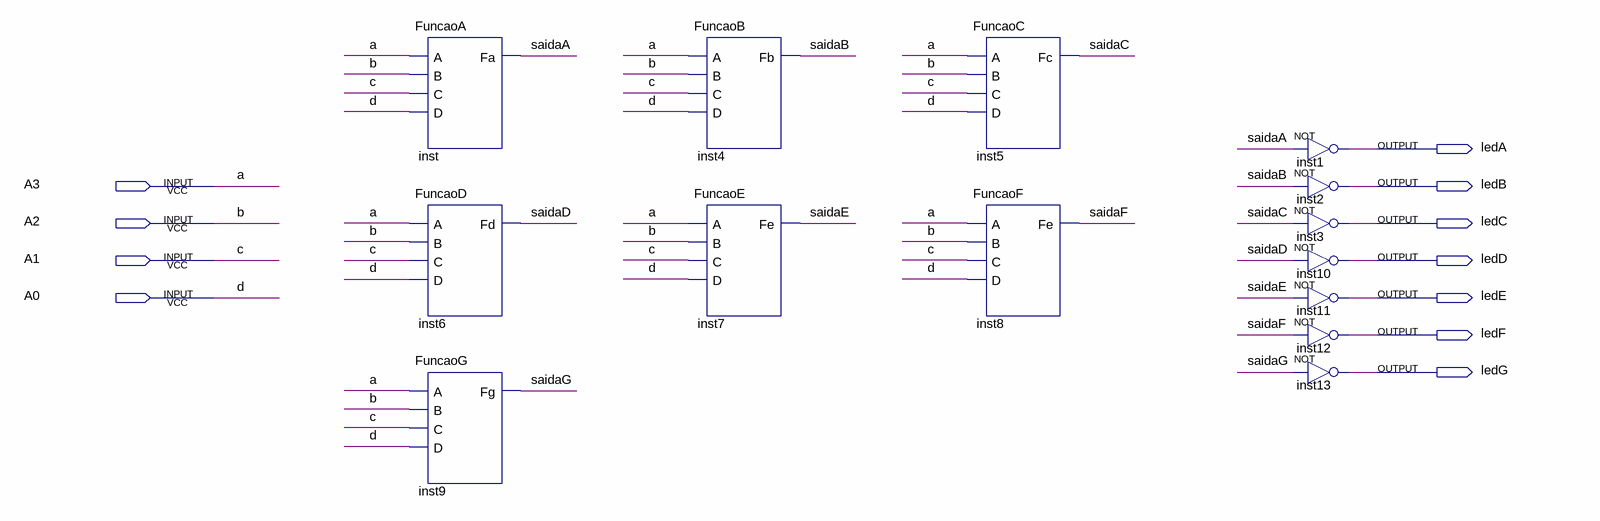
[diagram p0: schematic sheet]
// Quartus schematic Display7Segmentos.bdf as structural Verilog: 14 symbols, 11 pins
module Display7Segmentos (
  input  A3,
  input  A2,
  input  A1,
  input  A0,
  output ledA,
  output ledB,
  output ledC,
  output ledD,
  output ledE,
  output ledF,
  output ledG
);

  wire saidaA, saidaB, saidaC, saidaD, saidaE, saidaF, saidaG;

  FuncaoA inst (.A(A3), .B(A2), .C(A1), .D(A0), .Fa(saidaA));
  FuncaoD inst6 (.A(A3), .B(A2), .C(A1), .D(A0), .Fd(saidaD));
  FuncaoG inst9 (.A(A3), .B(A2), .C(A1), .D(A0), .Fg(saidaG));
  FuncaoB inst4 (.A(A3), .B(A2), .C(A1), .D(A0), .Fb(saidaB));
  FuncaoE inst7 (.A(A3), .B(A2), .C(A1), .D(A0), .Fe(saidaE));
  FuncaoC inst5 (.A(A3), .B(A2), .C(A1), .D(A0), .Fc(saidaC));
  FuncaoF inst8 (.A(A3), .B(A2), .C(A1), .D(A0), .Fe(saidaF));
  not inst1 (ledA, saidaA);
  not inst2 (ledB, saidaB);
  not inst3 (ledC, saidaC);
  not inst10 (ledD, saidaD);
  not inst11 (ledE, saidaE);
  not inst12 (ledF, saidaF);
  not inst13 (ledG, saidaG);

  // Other names for the same wires on the sheet: a = A3; b = A2; c = A1; d = A0
endmodule
